# EAGLE design hoekdrive23-test-fixture (EAGLE 5.12)

## Sheet 1 of 2
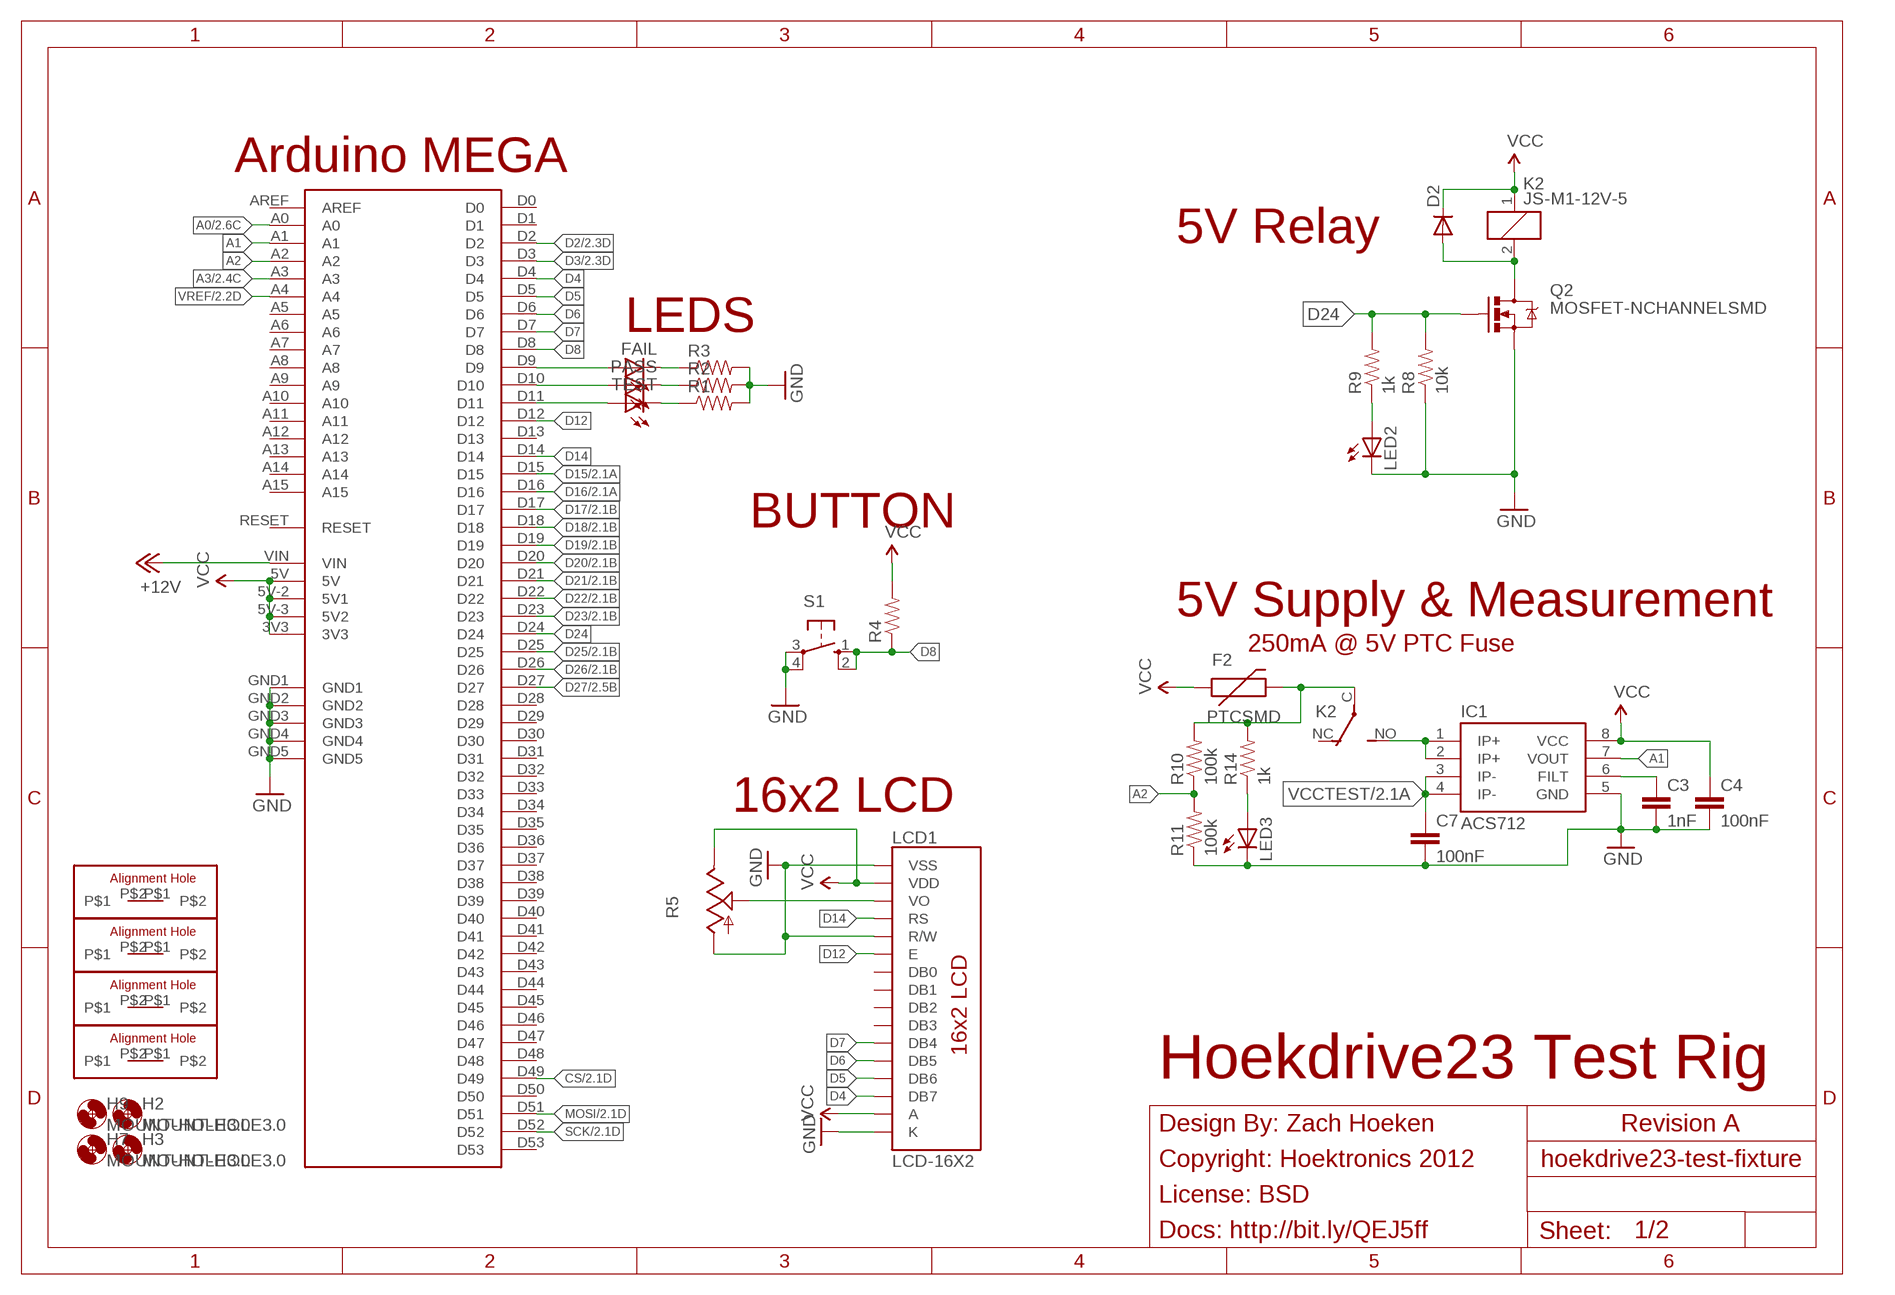
[diagram p0: schematic, sheet 1]

### Parts
C3  1nF  CAPACITOR0805  [0805-RC]
C4  100nF  CAPACITOR0805  [0805-RC]
C7  100nF  CAPACITOR0805  [0805-RC]
D2  DIODESMA  [SMA-DIODE]
F2  PTCSMD  [PTC-1206]
FAIL  LED10MM  [LED10MM]
H2  MOUNT-HOLE3.0  [3,0]
H3  MOUNT-HOLE3.0  [3,0]
H7  MOUNT-HOLE3.0  [3,0]
H9  MOUNT-HOLE3.0  [3,0]
IC1  ACS712  [SO08]
K2  JS-M1-12V-5  [JS-M]
LCD1  LCD-16X2  [LCD-16X2]
LED2  LED0805  [0805-LED]
LED3  LED0805  [0805-LED]
PASS  LED10MM  [LED10MM]
Q2  MOSFET-NCHANNELSMD  [SOT23-3]
R1  RESISTOR0805  [0805-RC]
R2  RESISTOR0805  [0805-RC]
R3  RESISTOR0805  [0805-RC]
R4  RESISTOR0805  [0805-RC]
R5  TRIM_US-B25P  [B25P]
R8  10k  RESISTOR0805  [0805-RC]
R9  1k  RESISTOR0805  [0805-RC]
R10  100k  RESISTOR0805  [0805-RC]
R11  100k  RESISTOR0805  [0805-RC]
R14  1k  RESISTOR0805  [0805-RC]
S1  40-XX  [B3F-40XX]
TEST  LED10MM  [LED10MM]
U$1  ARDUINO-MEGA  [ARDUINO-MEGA]
U$8  ALIGNMENT-HOLE2.5  [ALIGNMENT-HOLE-2.5MM]
U$9  ALIGNMENT-HOLE2.5  [ALIGNMENT-HOLE-2.5MM]
U$10  ALIGNMENT-HOLE2.5  [ALIGNMENT-HOLE-2.5MM]
U$11  ALIGNMENT-HOLE2.5  [ALIGNMENT-HOLE-2.5MM]

### Nets
+12V: U$1.VIN
A0: U$1.A0 ; also sheet 2
A1: IC1.7(VOUT) U$1.A1
A2: R10.1 R11.2 U$1.A2
A3: U$1.A3 ; also sheet 2
CS: U$1.D49 ; also sheet 2
D2: U$1.D2 ; also sheet 2
D3: U$1.D3 ; also sheet 2
D4: LCD1.14(DB7) U$1.D4
D5: LCD1.13(DB6) U$1.D5
D6: LCD1.12(DB5) U$1.D6
D7: LCD1.11(DB4) U$1.D7
D8: R4.1 S1.1(S) S1.2(S1) U$1.D8
D12: LCD1.6(E) U$1.D12
D14: LCD1.4(RS) U$1.D14
D15: U$1.D15 ; also sheet 2
D16: U$1.D16 ; also sheet 2
D17: U$1.D17 ; also sheet 2
D18: U$1.D18 ; also sheet 2
D19: U$1.D19 ; also sheet 2
D20: U$1.D20 ; also sheet 2
D21: U$1.D21 ; also sheet 2
D22: U$1.D22 ; also sheet 2
D23: U$1.D23 ; also sheet 2
D24: Q2.1(G) R8.2 R9.2 U$1.D24
D25: U$1.D25 ; also sheet 2
D26: U$1.D26 ; also sheet 2
D27: U$1.D27 ; also sheet 2
GND: C3.2 C4.2 C7.2 IC1.5(GND) LCD1.1(VSS) LCD1.5(R/W) LCD1.16(K) LED2.C LED3.C Q2.2(S) R1.2 R2.2 R3.2 R5.A R8.1 R11.1 S1.3(P) S1.4(P1) U$1.GND1 U$1.GND2 U$1.GND3 U$1.GND4 U$1.GND5 ; also sheet 2
MOSI: U$1.D51 ; also sheet 2
N$2: LED3.A R14.1
N$3: C3.1 IC1.6(FILT)
N$5: FAIL.A U$1.D9
N$6: PASS.A U$1.D10
N$7: TEST.A U$1.D11
N$8: FAIL.C R3.1
N$9: PASS.C R2.1
N$10: R1.1 TEST.C
N$18: F2.2 K2.C(2:P) R10.2 R14.2
N$19: LCD1.3(VO) R5.S
N$20: D2.A K2.2 Q2.3(D)
N$21: LED2.A R9.1
N$22: IC1.1(IP+) IC1.2(IP+) K2.NO(2:S)
SCK: U$1.D52 ; also sheet 2
VCC: C4.1 D2.C F2.1 IC1.8(VCC) K2.1 LCD1.2(VDD) LCD1.15(A) R4.2 R5.E U$1.3V3 U$1.5V U$1.5V-2(5V1) U$1.5V-3(5V2) ; also sheet 2
VCCTEST: C7.1 IC1.3(IP-) IC1.4(IP-) ; also sheet 2
VREF: U$1.A4 ; also sheet 2
Unconnected: K2.NC(2:O) LCD1.7(DB0) LCD1.8(DB1) LCD1.9(DB2) LCD1.10(DB3) U$1.A5 U$1.A6 U$1.A7 U$1.A8 U$1.A9 U$1.A10 U$1.A11 U$1.A12 U$1.A13 U$1.A14 U$1.A15 U$1.AREF U$1.D0 U$1.D1 U$1.D13 U$1.D28 U$1.D29 U$1.D30 U$1.D31 U$1.D32 U$1.D33 U$1.D34 U$1.D35 U$1.D36 U$1.D37 U$1.D38 U$1.D39 U$1.D40 U$1.D41 U$1.D42 U$1.D43 U$1.D44 U$1.D45 U$1.D46 U$1.D47 U$1.D48 U$1.D50 U$1.D53 U$1.RESET U$8.P$1 U$8.P$2 U$9.P$1 U$9.P$2 U$10.P$1 U$10.P$2 U$11.P$1 U$11.P$2

### Notes on the sheet
- Arduino MEGA
- 5V Relay
- LEDS
- BUTTON
- 5V Supply & Measurement
- 250mA @ 5V PTC Fuse
- 16x2 LCD
- Hoekdrive23 Test Rig
- Design By: Zach Hoeken | Revision A
- Copyright: Hoektronics 2012
- License: BSD
- Docs: http://bit.ly/QEJ5ff

## Sheet 2 of 2
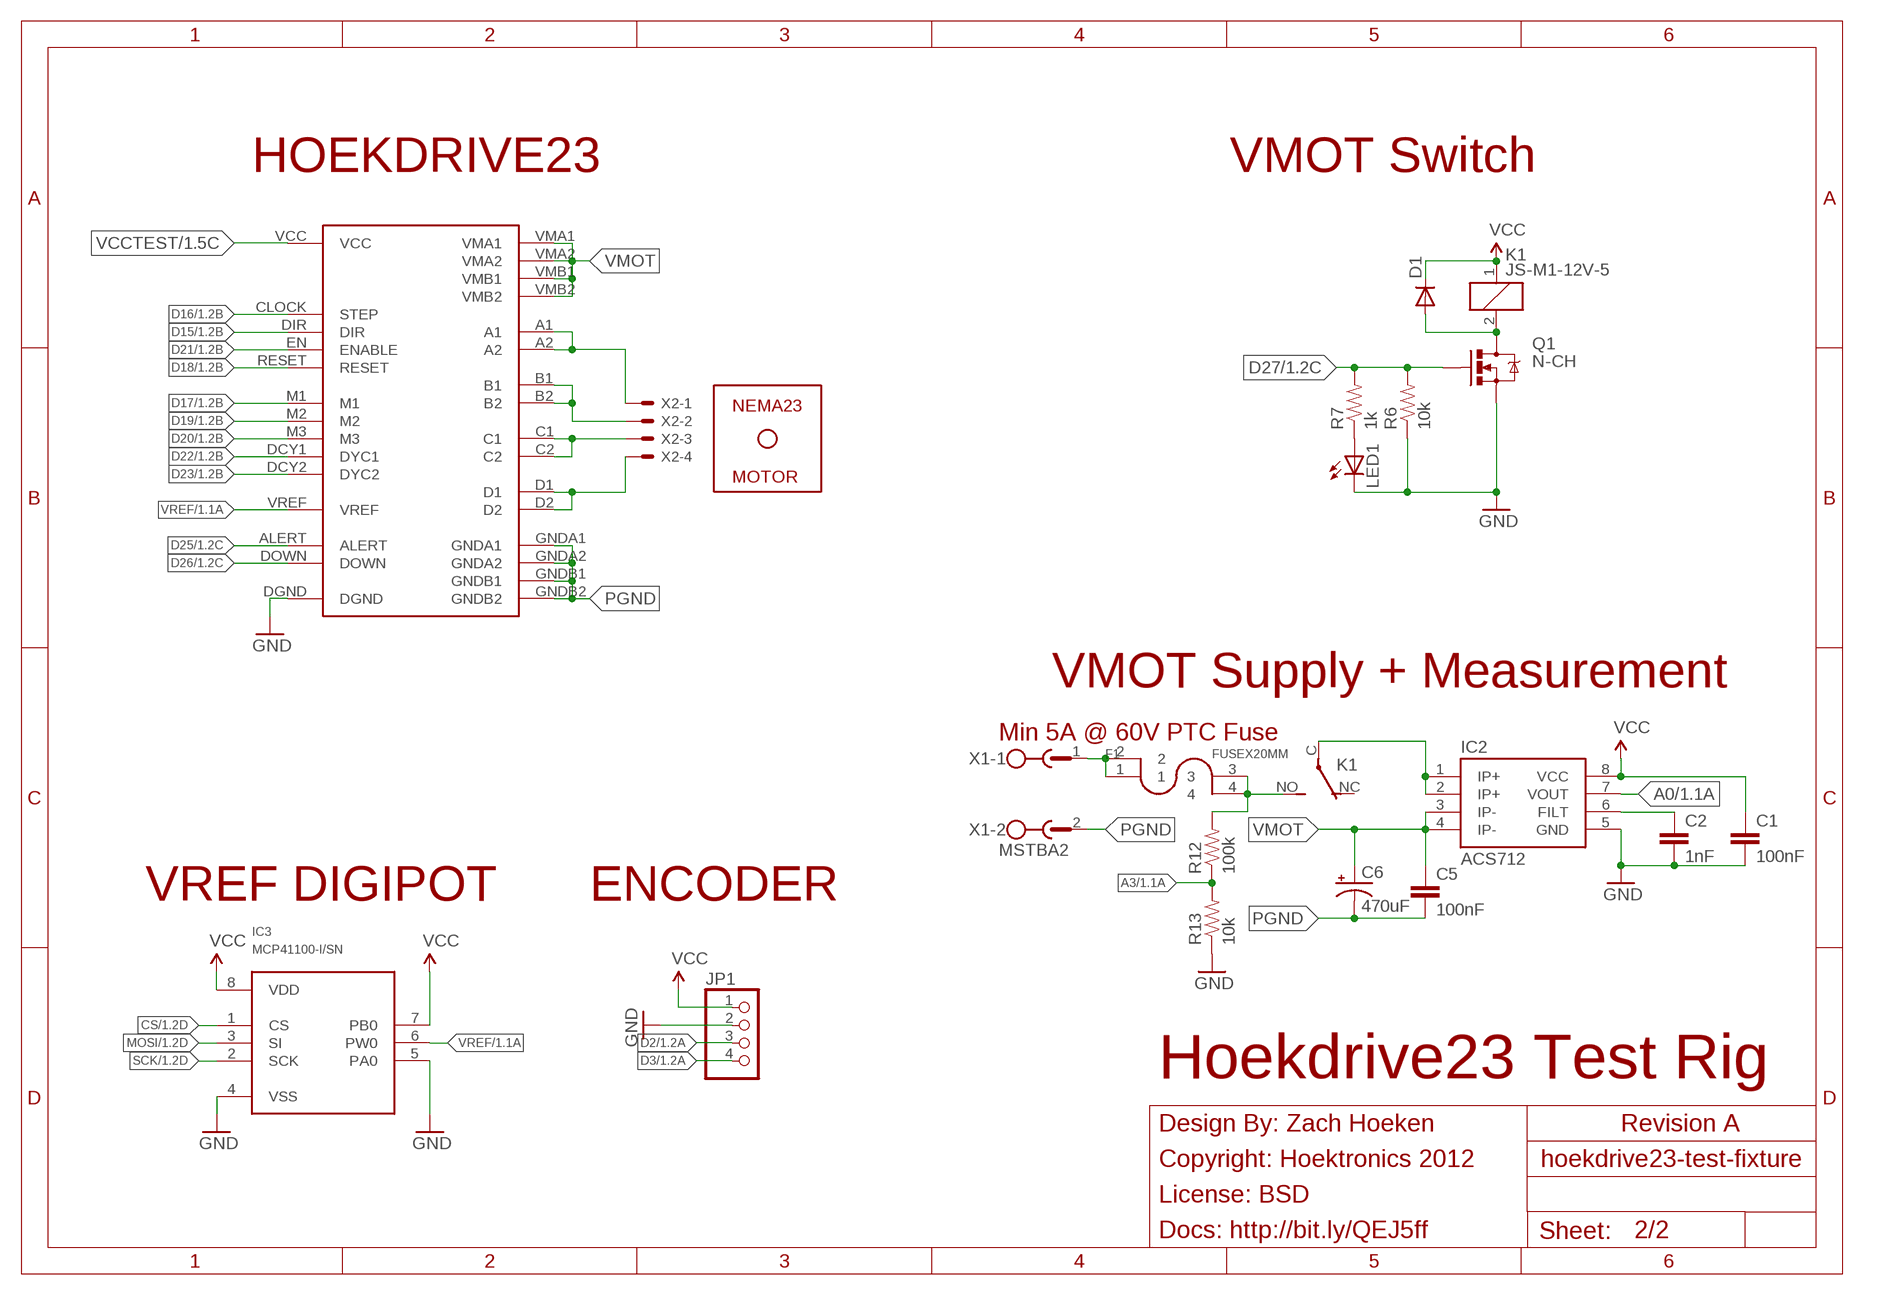
[diagram p1: schematic, sheet 2]

### Parts
C1  100nF  CAPACITOR0805  [0805-RC]
C2  1nF  CAPACITOR0805  [0805-RC]
C5  100nF  CAPACITOR0805  [0805-RC]
C6  470uF  CPOL-USE5-10.5  [E5-10,5]
D1  DIODESMA  [SMA-DIODE]
F1  FUSEX20MM  [FUSE_5MM]
IC2  ACS712  [SO08]
IC3  MCP41100-I/SN  MCP41XXX  [SO-08]
JP1  PINHD-1X4  [1X04]
K1  JS-M1-12V-5  [JS-M]
LED1  LED0805  [0805-LED]
M2  HOEKSTEP23  [HOEKSTEP23]
Q1  N-CH  MOSFET-NCHANNELSMD  [SOT23-3]
R6  10k  RESISTOR0805  [0805-RC]
R7  1k  RESISTOR0805  [0805-RC]
R12  100k  RESISTOR0805  [0805-RC]
R13  10k  RESISTOR0805  [0805-RC]
U$4  NEMA23  [NEMA23]
X1  MSTBA2  [MSTBA2]
X2  KK-156-4  [KK-156-4]

### Nets
A0: IC2.7(VOUT) ; also sheet 1
A3: R12.1 R13.2 ; also sheet 1
CS: IC3.1(CS) ; also sheet 1
D2: JP1.3 ; also sheet 1
D3: JP1.4 ; also sheet 1
D15: M2.DIR ; also sheet 1
D16: M2.CLOCK(STEP) ; also sheet 1
D17: M2.M1 ; also sheet 1
D18: M2.RESET ; also sheet 1
D19: M2.M2 ; also sheet 1
D20: M2.M3 ; also sheet 1
D21: M2.EN(ENABLE) ; also sheet 1
D22: M2.DCY1(DYC1) ; also sheet 1
D23: M2.DCY2(DYC2) ; also sheet 1
D25: M2.ALERT ; also sheet 1
D26: M2.DOWN ; also sheet 1
D27: Q1.1(G) R6.2 R7.2 ; also sheet 1
GND: C1.2 C2.2 IC2.5(GND) IC3.4(VSS) IC3.5(PA0) JP1.2 LED1.C M2.DGND Q1.2(S) R6.1 R13.1 ; also sheet 1
MOSI: IC3.3(SI) ; also sheet 1
N$1: F1.1 F1.2 X1.1
N$4: M2.B1 M2.B2 X2.2
N$11: C2.1 IC2.6(FILT)
N$12: M2.C1 M2.C2 X2.3
N$13: M2.A1 M2.A2 X2.1
N$14: M2.D1 M2.D2 X2.4
N$15: D1.A K1.2 Q1.3(D)
N$16: F1.3 F1.4 K1.NO(2:S) R12.2
N$17: LED1.A R7.1
PGND: C5.2 C6.- M2.GNDA1 M2.GNDA2 M2.GNDB1 M2.GNDB2 X1.2
PGNDIN: IC2.1(IP+) IC2.2(IP+) K1.C(2:P)
SCK: IC3.2(SCK) ; also sheet 1
VCC: C1.1 D1.C IC2.8(VCC) IC3.7(PB0) IC3.8(VDD) JP1.1 K1.1 ; also sheet 1
VCCTEST: M2.VCC ; also sheet 1
VMOT: C5.1 C6.+ IC2.3(IP-) IC2.4(IP-) M2.VMA1 M2.VMA2 M2.VMB1 M2.VMB2
VREF: IC3.6(PW0) M2.VREF ; also sheet 1
Unconnected: K1.NC(2:O)

### Notes on the sheet
- HOEKDRIVE23 | VMOT Switch
- VMOT Supply + Measurement
- Min 5A @ 60V PTC Fuse
- VREF DIGIPOT | ENCODER
- Hoekdrive23 Test Rig
- Design By: Zach Hoeken | Revision A
- Copyright: Hoektronics 2012
- License: BSD
- Docs: http://bit.ly/QEJ5ff

## Library data of the parts
C1-C5 C7 = Hoektronics:CAPACITOR: Capacitor Standard 0603 ceramic capacitor, and 0.1" leaded capacitor.
C6 = rcl:CPOL-US: POLARIZED CAPACITOR, American symbol
D1 D2 = SparkFun:DIODE: Diode These are standard reverse protection diodes and small signal diodes. SMA package can handle up to about 1A. SOD-323 can handle about 200mA. What the SOD-323 package when ordering, there are some mfgs out there that are 5-pin packages.
F1 = Hoektronics:FUSE: Littelfuse 01000020Z - 20A @
F2 = SparkFun:PTC: Resettable Fuse PTC Resettable Fuse. Spark Fun Electronics SKU : COM-08357
FAIL LED1-LED3 PASS TEST = Hoektronics:LED: LEDs Standard schematic elements and footprints for 5mm, 3mm, 1206, and 0603 sized LEDs. 5mm - Spark Fun Electronics SKU : COM-00529 (and others)
H2 H3 H7 H9 = holes:MOUNT-HOLE: MOUNTING HOLE with drill center marker
IC1 IC2 = SparkFun:ACS712
IC3 = Hoektronics:MCP41XXX
JP1 = pinhead:PINHD-1X4: PIN HEADER
K1 K2 = relay:JS-M1*: Automotive Ultra-Miniature Power Relay NAiS Source: http://www.mew-europe.com/.. en_ds_61211_0000.pdf; MF: FARNELL; MPN: JSM1-12V-5; OC_FARNELL: 910351; OC_NEWARK: 14J1764
LCD1 = SparkFun:LCD-16X2
M2 = Hoektronics:HOEKSTEP23
Q1 Q2 = SparkFun:MOSFET-NCHANNEL
R1-R4 R6-R14 = Hoektronics:RESISTOR: Resistor Basic schematic elements and footprints for 0603, 1206, and PTH 1/10th watt (small) resistors.
R5 = pot:TRIM_US-: POTENTIOMETER
S1 = switch-omron:40-XX: OMRON SWITCH; MF: OMRON COMPONENTS USA; MPN: B3F-4000; OC_FARNELL: 176434; OC_NEWARK: 36K3105
U$1 = MakerBot:ARDUINO-MEGA
U$4 = Hoektronics:NEMA23
U$8-U$11 = Hoektronics:ALIGNMENT-HOLE
X1 = con-phoenix-508:MSTBA2: PHOENIX; MF: FARNELL; MPN: 1757242; OC_FARNELL: 3705171; OC_NEWARK: 71C4161
X2 = con-molex:KK-156-4: KK 156 HEADER Source: http://www.molex.com/pdm_docs/sd/026604100_sd.pdf; OC_FARNELL: unknown; OC_NEWARK: unknown

## Net classes
0 default: width 0.381 mm, clearance 0.381 mm

## Board
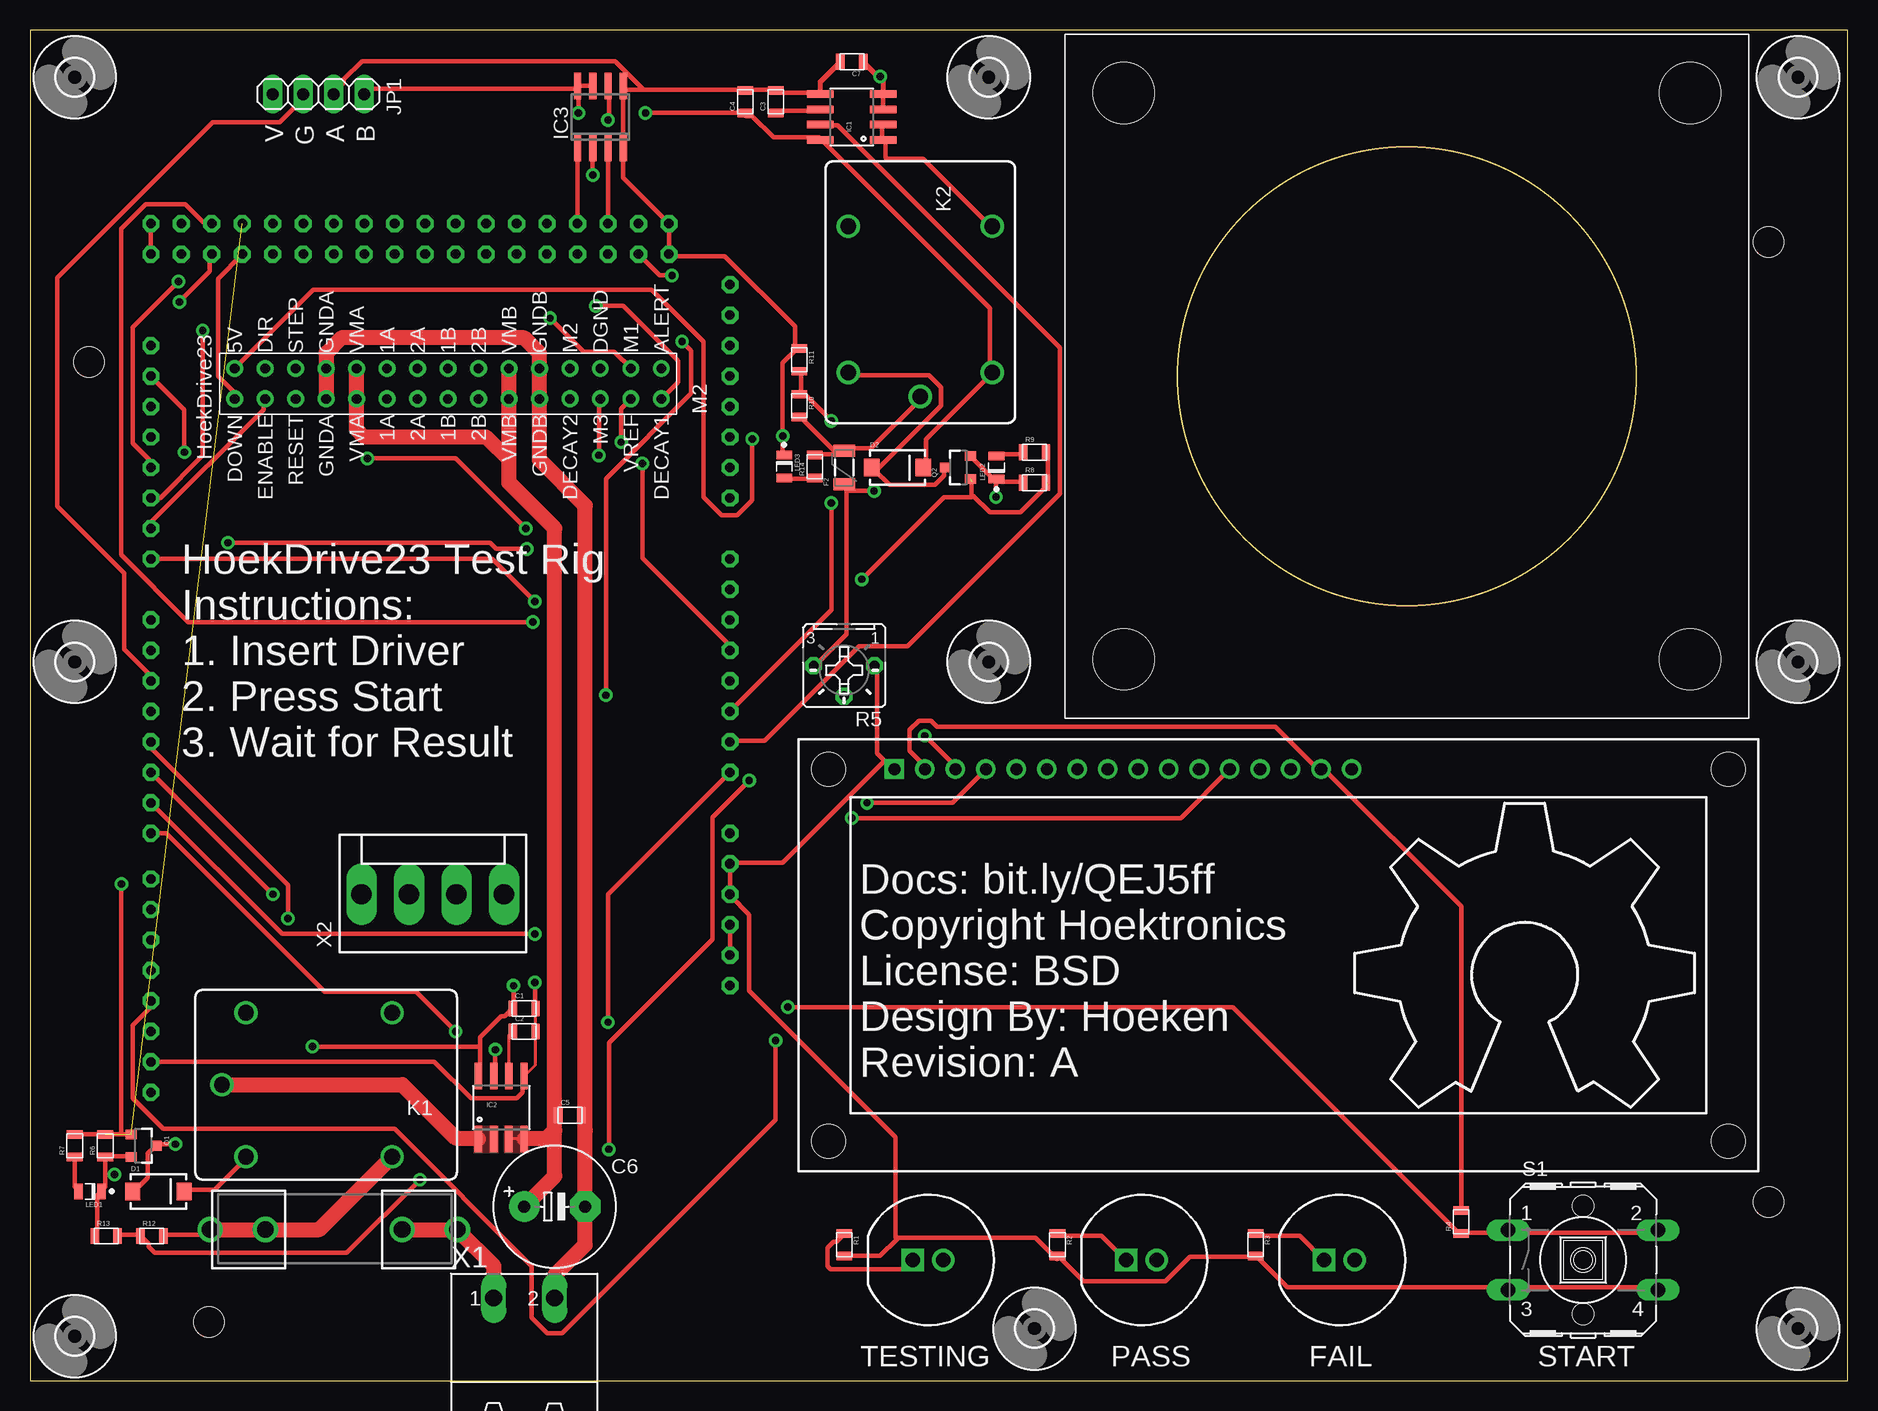
[diagram p2: board, top side]
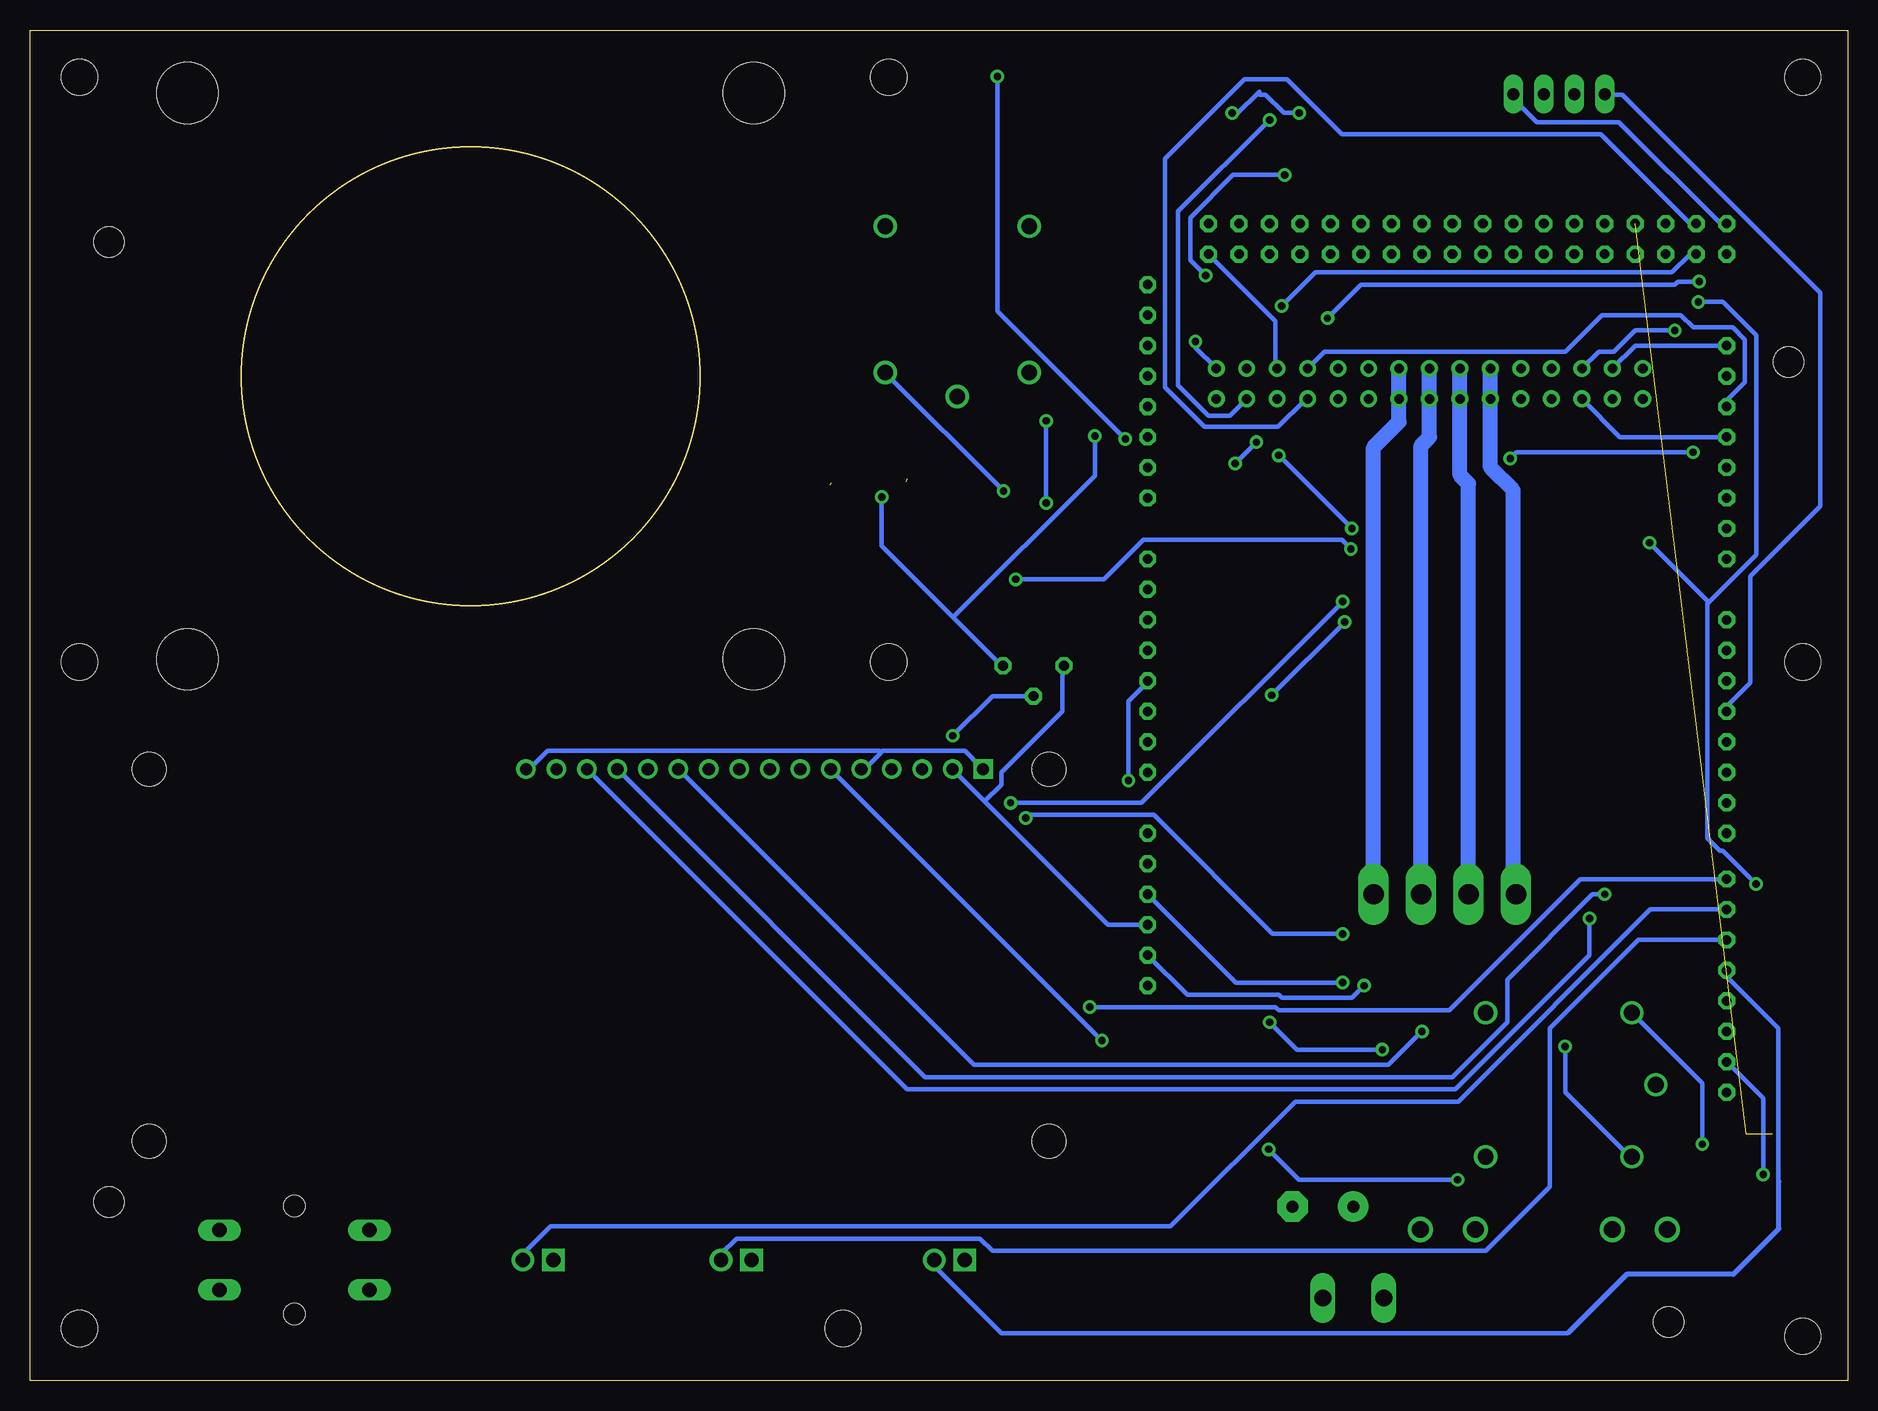
[diagram p3: board, bottom side, seen from below]

Size 151.5 x 112.58 mm. Coordinates in mm from the lower left corner, seen from the top.
Outline: 0,0 151.5,0 151.5,112.58 0,112.58 0,0
Copper layers (1*16): Top 0.035mm / dielectric 1.5mm / Bottom 0.035mm
Design rules "hoektronics": minimum track width 8mil, minimum drill 20mil, track to track 8mil, track to pad 8mil, pad to pad 8mil, via to via 8mil, smd to smd 8mil, copper to edge 10mil, drill to drill 8mil, minimum pad ring 12mil, minimum via ring 10mil, stop-mask expansion 4mil, vias tented up to drill 25mil, thermal gap 10mil

### Footprints (pad centres in the part's own frame; a part is rotated, then mirrored left to right if it is on the bottom)
0805-RC = smd 0.7 x 1.3: 1 -0.95,0; 2 0.95,0
E5-10,5 = drill 1.016 pad 2.54 round: + -2.54,0 | drill 1.016 pad 2.54 octagon: - 2.54,0
SMA-DIODE = smd 1.27 x 1.47: A -2.15,0; C 2.15,0
FUSE_5MM = drill 1.4 round: 1 0,10.3; 2 0,5.7; 3 0,-5.7; 4 0,-10.3
PTC-1206 = smd 1 x 1.8: 1 -1.4,0; 2 1.4,0
LED10MM = drill 1.2 pad 1.88 round: A 1.27,0 | drill 1.2 pad 1.88 square: C -1.27,0
3,0 = hole 3: 0,0
SO08 = smd 0.61 x 2.21: 1 -1.905,-2.616; 2 -0.635,-2.616; 3 0.635,-2.616; 4 1.905,-2.616; 5 1.905,2.616; 6 0.635,2.616; 7 -0.635,2.616; 8 -1.905,2.616
SO-08 = smd 0.6 x 2.2: 1 -1.905,-2.6; 2 -0.635,-2.6; 3 0.635,-2.6; 4 1.905,-2.6; 5 1.905,2.6; 6 0.635,2.6; 7 -0.635,2.6; 8 -1.905,2.6
1X04 = drill 1.016 long: 1 -3.81,0; 2 -1.27,0; 3 1.27,0; 4 3.81,0
JS-M = drill 1.3 round: 1 6.7,6; 2 6.7,-6; C 8.7,0; NC -5.5,-6; NO -5.5,6
LCD-16X2 = drill 1.016 square: 1 -32,15.5 | drill 1.016 round: 2 -29.46,15.5; 3 -26.92,15.5; 4 -24.38,15.5; 5 -21.84,15.5; 6 -19.3,15.5; 7 -16.76,15.5; 8 -14.22,15.5; 9 -11.68,15.5; 10 -9.14,15.5; 11 -6.6,15.5; 12 -4.06,15.5; 13 -1.52,15.5; 14 1.02,15.5; 15 3.56,15.5; 16 6.1,15.5 | hole 2.8: -37.5,15.5; -37.5,-15.5; 37.5,15.5; 37.5,-15.5
0805-LED = smd 0.7 x 1.3: A 0.95,0; C -0.95,0
HOEKSTEP23 = drill 0.8 round: A1 -1.27,3.81; A2 1.27,3.81; ALERT 1.27,-19.05; B1 -1.27,1.27; B2 1.27,1.27; C1 -1.27,-1.27; C2 1.27,-1.27; CLOCK 1.27,11.43; D1 -1.27,-3.81; D2 1.27,-3.81; DCY1 -1.27,-19.05; DCY2 -1.27,-11.43; DGND 1.27,-13.97; DIR -1.27,13.97; DOWN -1.27,16.51; EN 1.27,13.97; GNDA1 -1.27,8.89; GNDA2 1.27,8.89; GNDB1 -1.27,-8.89; GNDB2 1.27,-8.89; M1 1.27,-16.51; M2 1.27,-11.43; M3 -1.27,-13.97; RESET -1.27,11.43; VCC 1.27,16.51; VMA1 -1.27,6.35; VMA2 1.27,6.35; VMB1 -1.27,-6.35; VMB2 1.27,-6.35; VREF -1.27,-16.51
SOT23-3 = smd 0.8 x 0.9: 1 -0.95,-1; 2 0.95,-1; 3 0,1.1
B25P = drill 0.813 octagon: A -2.54,0; E 2.54,0; S 0,2.54
B3F-40XX = drill 1.194 long: 1 -6.248,2.489; 2 6.248,2.489; 3 -6.248,-2.489; 4 6.248,-2.489 | hole 1.803: 0,-4.496; 0,4.496
ARDUINO-MEGA = drill 0.8 octagon: 3V3 35.56,2.54; 5V 93.98,50.8; 5V-2 96.52,50.8; 5V-3 38.1,2.54; A0 50.8,2.54; A1 53.34,2.54; A2 55.88,2.54; A3 58.42,2.54; A4 60.96,2.54; A5 63.5,2.54; A6 66.04,2.54; A7 68.58,2.54; A8 73.66,2.54; A9 76.2,2.54; A10 78.74,2.54; A11 81.28,2.54; A12 83.82,2.54; A13 86.36,2.54; A14 88.9,2.54; A15 91.44,2.54; AREF 24.13,50.8; D0 63.5,50.8; D1 60.96,50.8; D2 58.42,50.8; D3 55.88,50.8; D4 53.34,50.8; D5 50.8,50.8; D6 48.26,50.8; D7 45.72,50.8; D8 41.91,50.8; D9 39.37,50.8; D10 36.83,50.8; D11 34.29,50.8; D12 31.75,50.8; D13 29.21,50.8; D14 68.58,50.8; D15 71.12,50.8; D16 73.66,50.8; D17 76.2,50.8; D18 78.74,50.8; D19 81.28,50.8; D20 83.82,50.8; D21 86.36,50.8; D22 93.98,48.26; D23 96.52,48.26; D24 93.98,45.72; D25 96.52,45.72; D26 93.98,43.18; D27 96.52,43.18; D28 93.98,40.64; D29 96.52,40.64; D30 93.98,38.1; D31 96.52,38.1; D32 93.98,35.56; D33 96.52,35.56; D34 93.98,33.02; D35 96.52,33.02; D36 93.98,30.48; D37 96.52,30.48; D38 93.98,27.94; D39 96.52,27.94; D40 93.98,25.4; D41 96.52,25.4; D42 93.98,22.86; D43 96.52,22.86; D44 93.98,20.32; D45 96.52,20.32; D46 93.98,17.78; D47 96.52,17.78; D48 93.98,15.24; D49 96.52,15.24; D50 93.98,12.7; D51 96.52,12.7; D52 93.98,10.16; D53 96.52,10.16; GND1 26.67,50.8; GND2 93.98,7.62; GND3 96.52,7.62; GND4 40.64,2.54; GND5 43.18,2.54; RESET 33.02,2.54; VIN 45.72,2.54
NEMA23 = hole 5.1: 23.6,-23.6; 23.6,23.6; -23.6,23.6; -23.6,-23.6
ALIGNMENT-HOLE-2.5MM = smd 2.5 x 2.5: P$1 0,0 | smd 2.5 x 2.5 bottom: P$2 0,0 | hole 2.5: 0,0
MSTBA2 = drill 1.397 long: 1 -2.54,5.08; 2 2.54,5.08
KK-156-4 = drill 1.7 pad 2.184 long: 1 -5.94,0; 2 -1.98,0; 3 1.98,0; 4 5.94,0

### Placement (x,y rotation side)
C1  41.2,31.04 0 top
C2  41.2,29.13 0 top
C3  62.15,106.6 90 top
C4  59.61,106.6 90 top
C5  45.01,22.15 0 top
C6  43.73,14.53 0 top
C7  68.5,109.94 180 top
D1  10.71,15.79 0 top
D2  72.31,76.12 0 top
F1  25.32,12.62 270 top
F2  67.86,76.12 90 top
FAIL  109.14,10.08 0 top
H1  MOUNT-HOLE3.0  [3,0]  3.73,3.73 0 top
H2  147.38,4.37 0 top
H3  147.38,108.65 0 top
H4  MOUNT-HOLE3.0  [3,0]  3.73,108.65 0 top
H5  MOUNT-HOLE3.0  [3,0]  79.92,108.65 0 top
H6  MOUNT-HOLE3.0  [3,0]  83.73,4.37 0 top
H7  79.92,59.92 0 top
H8  MOUNT-HOLE3.0  [3,0]  3.73,59.92 0 top
H9  147.38,59.92 0 top
IC1  68.5,105.33 90 top
IC2  39.29,22.78 0 top
IC3  47.55,105.33 0 top
JP1  24.05,107.23 180 top
K1  24.69,24.69 180 top
K2  74.22,90.73 270 top
LCD1  104.06,35.48 0 top
LED1  5,15.79 180 top
LED2  80.56,76.12 90 top
LED3  62.86,76.2 270 top
M2  33.58,83.11 90 top
PASS  92.63,10.08 0 top
Q1  9.45,19.6 270 top
Q2  77.39,76.12 90 top
R1  67.86,11.35 270 top
R2  85.64,11.35 270 top
R3  102.16,11.35 270 top
R4  119.3,13.26 90 top
R5  67.86,59.61 180 top
R6  6.27,19.6 90 top
R7  3.73,19.6 90 top
R8  83.74,74.85 0 top
R9  83.74,77.39 0 top
R10  64.14,81.28 270 top
R11  64.14,85.09 270 top
R12  10.16,12.06 0 top
R13  6.35,12.06 0 top
R14  65.41,76.2 90 top
S1  129.46,10.08 0 top
TEST  74.85,10.08 0 top
U$1  60.88,-0.08 90 top
U$2  [OSHW_10X1000_NOTEXT]  110.41,22.78 0 top
U$4  114.78,83.74 0 top
U$8  4.92,84.92 0 top
U$9  14.92,4.92 0 top
U$10  144.92,14.92 0 top
U$11  144.92,94.92 0 top
X1  41.2,1.83 0 top
X2  33.58,40.56 0 top

### Tracks (layer width: path | path; a pad name or v marks a point on that pad's centre or on a via)
A0  (via drill 0.61)
  Top 0.381: v38.78,27.61 38.78,25.57 IC2.7 | v48.18,29.89 48.18,40.56 U$1.A0
  Bottom 0.381: v38.78,27.61 45.89,27.61 v48.18,29.89
A1
  Top 0.381: IC1.7 66.04,104.65 67.31,104.65 85.85,86.11 85.85,73.91 73.15,61.21 69.09,61.21 61.21,53.34 58.42,53.34 U$1.A1
A2  (via drill 0.61)
  Top 0.381: R11.2 64.26,84.07 64.26,82.3 R10.1 64.26,82.04 64.77,82.04 v66.8,80.01 | v66.8,73.15 66.8,64.26 U$1.A2
  Bottom 0.381: v66.8,73.15 v66.8,80.01
A3  (via drill 0.61)
  Top 0.381: R13.2 7.37,12.19 9.14,12.19 R12.1 9.4,11.94 9.91,11.43 9.91,11.18 10.41,10.67 26.42,10.67 v32.51,16.76 | v48.26,19.3 48.26,28.19 56.9,36.83 56.9,46.99 v59.94,50.04
  Bottom 0.381: v32.51,16.76 45.72,16.76 v48.26,19.3 | v59.94,50.04 59.94,56.64 58.42,58.17 U$1.A3
CS
  Top 0.381: U$1.D49 IC3.1
D2
  Top 0.381: U$1.D2 9.91,58.42 9.91,58.93 7.87,60.96 7.87,67.31 2.29,72.9 2.29,91.95 15.24,104.9 20.83,104.9 22.61,106.68 22.61,107.19 JP1.3
D3
  Bottom 0.381: U$1.D3 9.91,55.88 9.91,56.39 8.13,58.17 8.13,67.06 2.29,72.9 2.29,90.68 18.8,107.19 20.07,107.19 JP1.4
D4  (via drill 0.61)
  Top 0.381: U$1.D4 10.08,52.75 21.51,41.32 v21.51,38.53
  Bottom 0.381: v21.51,38.53 21.51,35.48 32.69,24.3 78.41,24.3 LCD1.14
D5  (via drill 0.61)
  Top 0.381: v20.24,40.56 U$1.D5
  Bottom 0.381: v20.24,40.56 21.26,40.56 28.37,33.45 28.37,29.89 32.94,25.32 76.88,25.32 LCD1.13
D6  (via drill 0.61)
  Top 0.381: U$1.D6 21,37.26 v42.08,37.26 | v68.5,46.91 95.93,46.91 LCD1.12
  Bottom 0.381: v42.08,37.26 47.93,37.26 57.83,47.16 68.25,47.16 v68.5,46.91
D7  (via drill 0.61)
  Top 0.381: U$1.D7 11.35,45.64 24.56,32.43 32.18,32.43 v35.48,29.13
  Bottom 0.381: v35.48,29.13 38.27,26.34 72.82,26.34 LCD1.11
D8  (via drill 0.61)
  Top 0.381: v63.17,31.16 100.25,31.16 119.3,12.11 R4.1 119.3,12.37 123.11,12.37 S1.1 123.36,12.37 135.56,12.37 S1.2
  Bottom 0.381: U$1.D8 22.27,41.83 33.19,30.91 47.42,30.91 47.67,31.16 v63.17,31.16
D12  (via drill 0.61)
  Top 0.381: U$1.D12 10.08,31.16 8.56,29.64 8.56,23.54 11.1,21 30.4,21 41.83,9.57 41.83,5.25 43.1,3.98 44.37,3.98 62.15,21.76 v62.15,28.37
  Bottom 0.381: v62.15,28.37 LCD1.6
D14  (via drill 0.61)
  Top 0.381: U$1.D14 38.53,68.5 v42.08,64.94 | v69.77,48.18 76.88,48.18 LCD1.4
  Bottom 0.381: v42.08,64.94 58.85,48.18 v69.77,48.18
D15
  Top 0.381: U$1.D15 10.08,71.55 19.48,80.95 19.48,81.71 M2.DIR
D16  (via drill 0.61)
  Top 0.381: U$1.D16 10.84,73.58 14.4,77.14 v14.4,87.55
  Bottom 0.381: v14.4,87.55 17.7,87.55 19.48,85.77 20.75,85.77 M2.CLOCK
D17  (via drill 0.61)
  Top 0.381: U$1.D17 10.08,76.63 8.56,78.15 8.56,87.8 v12.37,91.61 | v43.35,88.57 46.15,85.77 48.69,85.77 M2.M1
  Bottom 0.381: v12.37,91.61 14.14,91.61 14.4,91.36 40.56,91.36 v43.35,88.57
D18
  Bottom 0.381: U$1.D18 18.97,78.66 M2.RESET
D19
  Bottom 0.381: U$1.D19 10.08,81.71 8.56,83.23 8.56,86.79 9.57,87.8 12.87,87.8 13.89,88.82 20.49,88.82 23.54,85.77 43.61,85.77 M2.M2
D20  (via drill 0.61)
  Top 0.381: U$1.D20 12.87,80.95 v12.87,77.39 | v28.11,76.88 35.48,76.88 v41.32,71.04 | v47.42,77.14 47.42,81.71 M2.M3
  Bottom 0.381: v12.87,77.39 27.61,77.39 v28.11,76.88 | v41.32,71.04 v47.42,77.14
D21
  Bottom 0.381: U$1.D21 17.7,86.28 M2.EN
D22  (via drill 0.61)
  Top 0.381: v47.16,89.58 49.45,89.58 54.02,85.01 54.02,83.23 M2.DCY1
  Bottom 0.381: U$1.D22 13.13,93.9 14.65,92.38 44.37,92.38 v47.16,89.58
D23
  Bottom 0.381: U$1.D23 12.7,96.52 13.21,96.52 20.57,103.89 42.16,103.89 46.74,108.46 50.29,108.46 56.9,101.85 56.9,82.8 53.59,79.5 47.5,79.5 45.21,81.79 M2.DCY2
D24  (via drill 0.61)  (2 unrouted)
  Top 0.381: 78.49,74.93 78.49,73.91 78.61,73.79 | 78.61,73.79 80.01,72.39 82.55,72.39 84.84,74.68 | 6.35,20.57 7.62,20.57 | 7.62,20.57 8.38,20.57 | 7.62,20.57 v7.62,41.4 | v12.45,89.92 14.99,92.46 14.99,93.73 U$1.D24 | v69.34,66.8 76.2,73.66 78.49,73.66 78.61,73.79 | v41.4,69.34 38.86,69.34 38.35,69.85 v16.51,69.85 | R9.2 84.84,77.22 84.84,74.93 R8.2
  Bottom 0.381: v7.62,41.4 10.41,44.2 10.67,44.2 11.68,45.21 11.68,64.77 11.56,64.9 | 11.56,64.9 7.62,68.83 7.62,87.12 10.41,89.92 v12.45,89.92 | v69.34,66.8 61.98,66.8 58.67,70.1 42.16,70.1 v41.4,69.34 | 11.56,64.9 v16.51,69.85
D25  (via drill 0.61)
  Top 0.381: v41.91,63.25 13.21,63.25 7.62,68.83 7.62,96.01 9.65,98.04 12.95,98.04 14.48,96.52 14.99,96.52 U$1.D25 | v48.01,57.15 48.01,75.18 55.12,82.3 55.12,85.85 v54.36,86.61
  Bottom 0.381: v41.91,63.25 v48.01,57.15 | v54.36,86.61 54.36,86.11 M2.ALERT
D26
  Top 0.381: U$1.D26 15.67,91.87 15.67,83.74 16.94,82.47 16.94,81.96 M2.DOWN
D27  (2 unrouted)
  Top 0.381: R7.2 3.81,20.57 6.1,20.57 R6.2
GND  (via drill 0.61)
  Top 0.254: C1.2 C2.2 42.15,26.35 IC2.5
  Top 0.381: Q1.2 8.3,18.72 6.27,18.72 R6.1 6.27,17.19 | 6.27,17.19 6.27,16.18 6.02,15.92 LED1.C 5.84,15.75 5.59,15.49 5.59,12.19 R13.1 | 59.61,107.62 62.15,107.62 C3.2 62.15,107.36 65.71,107.36 IC1.5 | 49.45,107.62 IC3.4 49.45,100.25 U$1.GND3 U$1.GND2 53.34,93.73 57.91,93.73 63.75,87.88 63.75,86.11 R11.1 64.01,86.11 62.74,84.84 v62.74,78.74 62.74,77.22 LED3.C | 49.45,107.62 IC3.5 49.45,107.87 | 49.45,107.62 51.05,107.62 | 51.05,107.62 59.61,107.62 | 59.61,107.62 C4.2 | S1.4 135.56,7.79 123.36,7.79 S1.3 123.11,7.79 104.82,7.79 102.28,10.33 R3.2 102.03,10.33 96.69,10.33 94.66,8.3 87.8,8.3 85.77,10.33 R2.2 85.6,10.16 83.82,11.94 72.39,11.94 72.26,11.81 | U$1.GND1 33.7,26.59 36.75,23.54 40.56,23.54 41.07,24.05 41.07,25.32 IC2.5 | 6.27,17.19 v7.03,17.19 | v42.08,33.19 42.08,31.16 C1.2 | JP1.2 25.4,107.44 26.16,108.2 26.16,108.46 27.69,109.98 48.77,109.98 51.05,107.7 51.05,107.62 | 72.26,11.81 70.87,10.41 68.07,10.41 R1.2 | 72.26,11.81 72.14,11.94 72.14,20.32 59.94,32.51 59.94,38.86 58.42,40.39 U$1.GND4 U$1.GND5 58.42,43.18 62.74,43.18 71.25,51.69 | 80.52,74.93 78.49,76.96 Q2.2 | R8.1 82.55,74.93 80.77,74.93 LED2.C 80.52,74.93 | 71.25,51.69 71.88,51.05 LCD1.1 | 71.25,51.69 70.61,52.32 70.61,59.44 R5.A | v80.52,73.66 80.52,74.93
  Top 0.406: IC1.5 65.88,108.27 C7.2
  Bottom 0.381: U$1.GND2 47.67,88.31 47.67,84.5 M2.DGND | v7.03,17.19 7.03,23.54 U$1.GND1 | 80.56,52.37 80.44,52.5 73.58,52.5 72.31,51.23 LCD1.1 | 80.56,52.37 81.71,51.23 82.22,51.23 LCD1.5 | LCD1.16 110.16,51.23 109.65,51.23 108.38,52.5 80.69,52.5 80.56,52.37 | v42.08,33.19 50.97,33.19 U$1.GND4 | v80.52,73.66 80.52,69.6 74.55,63.63 | 74.55,63.63 70.61,59.69 R5.A | v62.74,78.74 62.74,75.44 74.55,63.63
MOSI
  Top 0.381: U$1.D51 IC3.3
N$1
  Top 1.27: X1.1 38.66,9.58 F1.1 F1.2
N$2
  Top 0.381: LED3.A 62.99,75.18 65.28,75.18 R14.1
N$3
  Top 0.381: C3.1 62.15,105.84 65.71,105.84 IC1.6
N$4
  Bottom 1.27: X2.2 31.59,74.78 32.3,75.48 M2.B1 M2.B2
N$5
  Bottom 0.381: U$1.D9 16.43,39.29 32.43,23.29 46.02,23.29 56.44,12.87 108.12,12.87 110.41,10.59 FAIL.A
N$6
  Bottom 0.381: U$1.D10 17.45,36.75 24.81,29.38 24.81,16.18 30.15,10.84 71.29,10.84 72.31,11.86 92.63,11.86 93.9,10.59 PASS.A
N$7
  Bottom 0.381: U$1.D11 10.08,33.7 5.76,29.38 5.76,16.68 | 23.32,3.98 70.53,3.98 76.12,9.57 TEST.A
  Bottom 0.406: 23.32,3.98 18.41,8.89 9.53,8.89 5.71,12.7 5.71,16.64 5.76,16.68
N$8
  Top 0.381: FAIL.C 105.84,12.11 102.28,12.11 R3.1
N$9
  Top 0.381: PASS.C 89.33,12.11 85.77,12.11 R2.1
N$10
  Top 0.381: TEST.C 72.82,9.32 66.72,9.32 66.47,9.57 66.47,11.1 66.98,11.6 67.23,11.6 67.74,12.11 R1.1
N$11
  Top 0.254: IC2.6 39.93,28.81 C2.1
N$12
  Bottom 1.27: X2.3 35.55,77.95 34.84,78.66 M2.C1 M2.C2
N$13
  Bottom 1.27: M2.A2 M2.A1 29.77,76.12 27.86,74.22 27.86,40.79 X2.1
N$14
  Bottom 1.27: M2.D2 M2.D1 37.39,79.93 39.52,77.8 X2.4
N$15  (via drill 0.61)
  Top 0.381: D1.A 8.81,15.92 9.83,16.94 9.83,18.97 10.33,19.48 Q1.3 10.59,19.73 v12.11,19.73
  Bottom 0.381: v12.11,19.73 12.11,24.81 K1.2
N$16
  Top 0.381: R12.2 11.18,12.19 14.73,12.19 F1.4
  Top 1.27: F1.4 F1.3 24.12,12.62 K1.NO
N$17
  Top 0.381: R7.1 3.73,16.18 3.98,15.92 LED1.A
N$18
  Top 0.381: 67.31,77.22 67.56,77.22 67.82,77.47 F2.2 | 67.31,77.22 65.53,77.22 R14.2 | 67.31,77.22 64.26,80.26 R10.2 | 67.31,77.22 F2.2 | F2.2 68.07,77.72 70.1,77.72 74.17,81.79 K2.C
N$19  (via drill 0.61)
  Top 0.381: v74.6,53.77 77.14,51.23 LCD1.3
  Bottom 0.381: v74.6,53.77 71.29,57.07 R5.S
N$20
  Top 0.381: Q2.3 76.2,75.95 76.2,75.44 75.44,74.68 71.63,74.68 70.36,75.95 D2.A 70.61,75.95 75.95,81.28 75.95,82.8 74.93,83.82 68.33,83.82 K2.2
N$21
  Top 0.381: LED2.A 80.77,77.22 82.55,77.22 R9.1
N$22
  Top 0.381: IC1.2 71.04,104.57 71.04,103.55 IC1.1 71.29,103.3 71.29,102.03 71.37,101.85 74.42,101.85 80.01,96.27 K2.NO
PGND
  Top 0.254: C5.2 45.95,21.2 46.27,20.88
  Top 1.27: X1.2 43.73,8.81 46.27,11.35 C6.- 46.27,20.88 46.27,72.95 42.47,76.75 M2.GNDB1 M2.GNDB2 42.47,85.64 41.2,86.92 25.95,86.92 24.69,85.64 M2.GNDA2 M2.GNDA1
PGNDIN
  Top 1.27: K1.C 31.04,24.69 35.48,20.24 37.31,20.24 IC2.1
  pour Top (no thermals): 37,21.26 39.04,21.26 39.04,18.97 37,18.97
SCK  (via drill 0.61)
  Top 0.381: v53.51,92.12 52.5,92.12 U$1.D52 | v46.91,100.5 IC3.2
  Bottom 0.381: v46.91,100.5 51.23,100.5 54.78,96.95 54.78,93.39 v53.51,92.12
VCC  (via drill 0.61)
  Top 0.381: U$1.5V-2 U$1.5V | R4.2 119.3,39.54 107.87,50.97 LCD1.15 107.62,51.23 107.11,51.23 103.81,54.53 75.61,54.53 75.1,55.04 74.09,55.04 73.33,54.28 73.33,52.5 74.6,51.23 LCD1.2 | 37.51,27.86 37.51,25.57 IC2.8 | 37.51,27.86 37.51,28.62 39.29,30.4 39.54,30.4 40.05,30.91 C1.1 40.31,31.16 v40.31,32.94 | D1.C 12.87,15.92 15.41,15.92 17.95,18.46 K1.1 | v23.54,27.86 37.51,27.86 | 65.45,59.61 R5.E 65.53,59.69 68.07,62.23 68.07,74.17 | U$1.3V3 U$1.5V-3 | IC3.8 45.72,107.95 46.74,107.95 IC3.7 | v51.31,105.66 59.44,105.66 C4.1 59.69,105.41 60.2,105.41 61.98,103.63 65.79,103.63 IC1.8 66.04,103.38 80.01,89.41 80.01,84.07 K2.1 74.68,78.49 74.68,76.2 D2.C | IC3.8 45.47,107.7 28.19,107.7 27.94,107.44 JP1.1 | v45.72,105.66 45.72,107.7 IC3.8 | 68.07,74.17 68.07,74.68 F2.1 | 68.07,74.17 v70.36,74.17
  Bottom 0.381: v23.54,27.86 23.54,24.05 18.21,18.72 K1.1 | 71.93,48.31 61.64,38.02 U$1.5V-3 | 71.93,48.31 LCD1.2 | 71.93,48.31 70.53,49.7 70.53,50.72 65.45,55.8 65.45,59.61 R5.E | v40.31,32.94 41.32,31.92 47.16,31.92 47.42,32.18 55.04,32.18 U$1.3V3 | v51.31,105.66 50.8,105.66 49.15,107.31 | 49.15,107.31 49.02,107.44 | U$1.5V-2 10.16,96.52 10.67,96.52 19.05,104.9 25.91,104.9 27.69,106.68 27.69,107.19 JP1.1 | v45.72,105.66 46.99,105.66 48.51,107.19 49.02,107.19 49.15,107.31 | v70.36,74.17 K2.1
VCCTEST  (via drill 0.61)
  Top 0.381: IC1.3 71.12,106.17 71.12,107.19 IC1.4 | v60.2,78.49 60.2,73.41 58.93,72.14 57.66,72.14 56.13,73.66 56.13,86.61 51.82,90.93 23.62,90.93 M2.VCC | v70.87,108.71 70.77,108.61
  Top 0.406: IC1.4 71.12,108.27 70.77,108.61 C7.1
  Bottom 0.381: v70.87,108.71 70.87,89.15 v60.2,78.49
VMOT
  Top 0.254: C5.1 44.05,21.2 43.73,20.88 | IC2.4 IC2.3
  Top 1.27: 43.73,20.88 43.02,20.16 IC2.4 | 43.73,20.88 43.73,71.04 39.93,74.85 39.93,76.75 | 39.93,76.75 M2.VMB1 M2.VMB2 | 39.93,76.75 38.02,78.66 27.86,78.66 27.23,79.3 M2.VMA1 M2.VMA2 | C6.+ 43.73,17.06 43.73,20.88
  pour Top (no thermals): 39.54,21.26 41.58,21.26 41.58,18.97 39.54,18.97
VREF  (via drill 0.61)
  Top 0.381: IC3.6 48.26,107.7 48.26,105.16 v48.18,105.08 | v51.05,76.45 51.05,68.58 58.17,61.47 58.17,60.96 U$1.A4 | v49.28,78.23 49.28,81.03 M2.VREF
  Bottom 0.381: v48.18,105.08 55.8,97.46 55.8,82.98 53.26,80.44 51.48,80.44 M2.VREF | v51.05,76.45 v49.28,78.23

### Text on the board
tPlace: V | G | A | B | HoekDrive23 Test Rig | Instructions: | 1. Insert Driver | 2. Press Start | 3. Wait for Result | Docs: bit.ly/QEJ5ff | Copyright Hoektronics | License: BSD | Design By: Hoeken | Revision: A | TESTING | PASS | FAIL | START